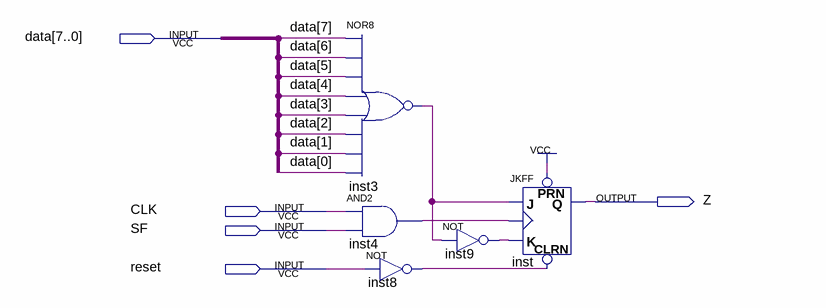
[diagram p0: schematic sheet]
// Quartus schematic ZFlag.bdf as structural Verilog: 5 symbols, 5 pins
module ZFlag (
  input  [7:0] data,
  input  CLK,
  input  SF,
  input  reset,
  output Z
);

  wire inst3_out, inst4_out, inst8_out, inst9_out;

  nor inst3 (inst3_out, data[7], data[6], data[5], data[4], data[3], data[2], data[1], data[0]);
  and inst4 (inst4_out, CLK, SF);
  not inst8 (inst8_out, reset);
  not inst9 (inst9_out, inst3_out);
  JKFF inst (.PRN(1'b1), .CLRN(inst8_out), .K(inst9_out), .J(inst3_out), .CLK(inst4_out), .Q(Z));
endmodule
